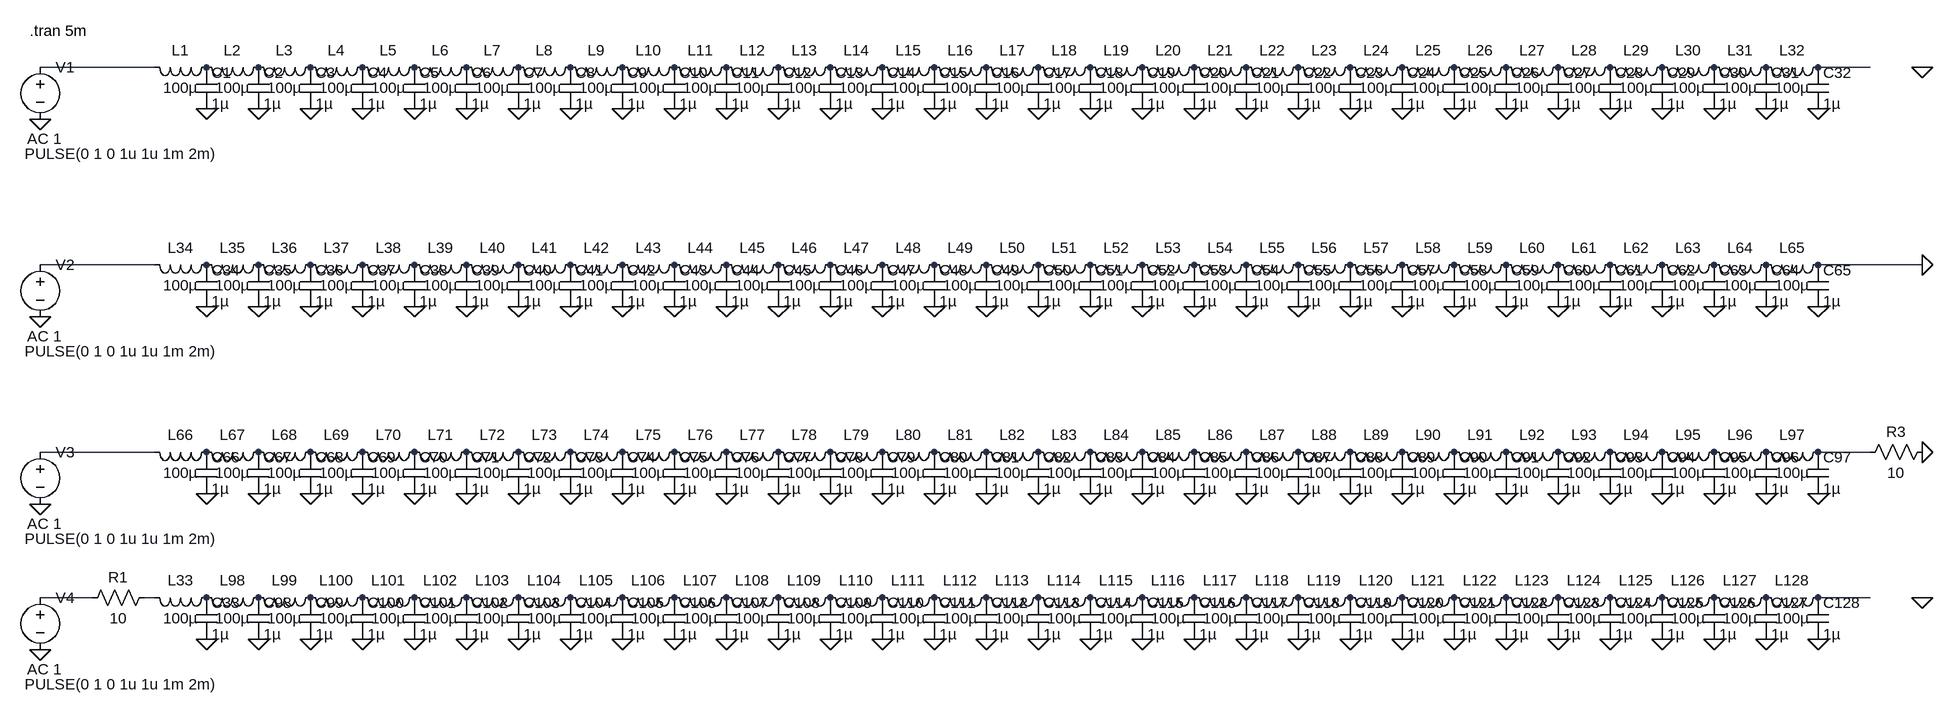
[diagram p0: schematic DistributedConstantCircuit.asc]
DistributedConstantCircuit.asc, the LTspice schematic file:
Version 4
SHEET 1 3316 1280
WIRE 64 96 -112 96
WIRE 2704 96 2624 96
WIRE 64 400 -112 400
WIRE 2784 400 2624 400
WIRE 64 688 -112 688
WIRE 2704 688 2624 688
WIRE -32 912 -112 912
WIRE 64 912 48 912
WIRE 2704 912 2624 912
FLAG -112 176 0
FLAG 144 160 0
FLAG 224 160 0
FLAG 304 160 0
FLAG 384 160 0
FLAG 464 160 0
FLAG 544 160 0
FLAG 624 160 0
FLAG 704 160 0
FLAG 784 160 0
FLAG 864 160 0
FLAG 944 160 0
FLAG 1024 160 0
FLAG 1104 160 0
FLAG 1184 160 0
FLAG 1264 160 0
FLAG 1344 160 0
FLAG 1424 160 0
FLAG 1504 160 0
FLAG 1584 160 0
FLAG 1664 160 0
FLAG 1744 160 0
FLAG 1824 160 0
FLAG 1904 160 0
FLAG 1984 160 0
FLAG 2064 160 0
FLAG 2144 160 0
FLAG 2224 160 0
FLAG 2304 160 0
FLAG 2384 160 0
FLAG 2464 160 0
FLAG 2544 160 0
FLAG 2624 160 0
FLAG 2784 96 0
FLAG -112 480 0
FLAG 144 464 0
FLAG 224 464 0
FLAG 304 464 0
FLAG 384 464 0
FLAG 464 464 0
FLAG 544 464 0
FLAG 624 464 0
FLAG 704 464 0
FLAG 784 464 0
FLAG 864 464 0
FLAG 944 464 0
FLAG 1024 464 0
FLAG 1104 464 0
FLAG 1184 464 0
FLAG 1264 464 0
FLAG 1344 464 0
FLAG 1424 464 0
FLAG 1504 464 0
FLAG 1584 464 0
FLAG 1664 464 0
FLAG 1744 464 0
FLAG 1824 464 0
FLAG 1904 464 0
FLAG 1984 464 0
FLAG 2064 464 0
FLAG 2144 464 0
FLAG 2224 464 0
FLAG 2304 464 0
FLAG 2384 464 0
FLAG 2464 464 0
FLAG 2544 464 0
FLAG 2624 464 0
FLAG 2784 400 0
FLAG -112 768 0
FLAG 144 752 0
FLAG 224 752 0
FLAG 304 752 0
FLAG 384 752 0
FLAG 464 752 0
FLAG 544 752 0
FLAG 624 752 0
FLAG 704 752 0
FLAG 784 752 0
FLAG 864 752 0
FLAG 944 752 0
FLAG 1024 752 0
FLAG 1104 752 0
FLAG 1184 752 0
FLAG 1264 752 0
FLAG 1344 752 0
FLAG 1424 752 0
FLAG 1504 752 0
FLAG 1584 752 0
FLAG 1664 752 0
FLAG 1744 752 0
FLAG 1824 752 0
FLAG 1904 752 0
FLAG 1984 752 0
FLAG 2064 752 0
FLAG 2144 752 0
FLAG 2224 752 0
FLAG 2304 752 0
FLAG 2384 752 0
FLAG 2464 752 0
FLAG 2544 752 0
FLAG 2624 752 0
FLAG 2784 688 0
FLAG -112 992 0
FLAG 144 976 0
FLAG 224 976 0
FLAG 304 976 0
FLAG 384 976 0
FLAG 464 976 0
FLAG 544 976 0
FLAG 624 976 0
FLAG 704 976 0
FLAG 784 976 0
FLAG 864 976 0
FLAG 944 976 0
FLAG 1024 976 0
FLAG 1104 976 0
FLAG 1184 976 0
FLAG 1264 976 0
FLAG 1344 976 0
FLAG 1424 976 0
FLAG 1504 976 0
FLAG 1584 976 0
FLAG 1664 976 0
FLAG 1744 976 0
FLAG 1824 976 0
FLAG 1904 976 0
FLAG 1984 976 0
FLAG 2064 976 0
FLAG 2144 976 0
FLAG 2224 976 0
FLAG 2304 976 0
FLAG 2384 976 0
FLAG 2464 976 0
FLAG 2544 976 0
FLAG 2624 976 0
FLAG 2784 912 0
SYMBOL ind 160 80 R90
WINDOW 0 5 56 VBottom 2
WINDOW 3 32 56 VTop 2
SYMATTR InstName L1
SYMATTR Value 100µ
SYMBOL cap 128 96 R0
SYMATTR InstName C1
SYMATTR Value 1µ
SYMBOL voltage -112 80 R0
WINDOW 3 -24 149 Left 2
WINDOW 123 -20 126 Left 2
WINDOW 39 0 0 Left 0
SYMATTR Value PULSE(0 1 0 1u 1u 1m 2m)
SYMATTR Value2 AC 1
SYMATTR InstName V1
SYMBOL ind 240 80 R90
WINDOW 0 5 56 VBottom 2
WINDOW 3 32 56 VTop 2
SYMATTR InstName L2
SYMATTR Value 100µ
SYMBOL cap 208 96 R0
SYMATTR InstName C2
SYMATTR Value 1µ
SYMBOL ind 320 80 R90
WINDOW 0 5 56 VBottom 2
WINDOW 3 32 56 VTop 2
SYMATTR InstName L3
SYMATTR Value 100µ
SYMBOL cap 288 96 R0
SYMATTR InstName C3
SYMATTR Value 1µ
SYMBOL ind 400 80 R90
WINDOW 0 5 56 VBottom 2
WINDOW 3 32 56 VTop 2
SYMATTR InstName L4
SYMATTR Value 100µ
SYMBOL cap 368 96 R0
SYMATTR InstName C4
SYMATTR Value 1µ
SYMBOL ind 480 80 R90
WINDOW 0 5 56 VBottom 2
WINDOW 3 32 56 VTop 2
SYMATTR InstName L5
SYMATTR Value 100µ
SYMBOL cap 448 96 R0
SYMATTR InstName C5
SYMATTR Value 1µ
SYMBOL ind 560 80 R90
WINDOW 0 5 56 VBottom 2
WINDOW 3 32 56 VTop 2
SYMATTR InstName L6
SYMATTR Value 100µ
SYMBOL cap 528 96 R0
SYMATTR InstName C6
SYMATTR Value 1µ
SYMBOL ind 640 80 R90
WINDOW 0 5 56 VBottom 2
WINDOW 3 32 56 VTop 2
SYMATTR InstName L7
SYMATTR Value 100µ
SYMBOL cap 608 96 R0
SYMATTR InstName C7
SYMATTR Value 1µ
SYMBOL ind 720 80 R90
WINDOW 0 5 56 VBottom 2
WINDOW 3 32 56 VTop 2
SYMATTR InstName L8
SYMATTR Value 100µ
SYMBOL cap 688 96 R0
SYMATTR InstName C8
SYMATTR Value 1µ
SYMBOL ind 800 80 R90
WINDOW 0 5 56 VBottom 2
WINDOW 3 32 56 VTop 2
SYMATTR InstName L9
SYMATTR Value 100µ
SYMBOL cap 768 96 R0
SYMATTR InstName C9
SYMATTR Value 1µ
SYMBOL ind 880 80 R90
WINDOW 0 5 56 VBottom 2
WINDOW 3 32 56 VTop 2
SYMATTR InstName L10
SYMATTR Value 100µ
SYMBOL cap 848 96 R0
SYMATTR InstName C10
SYMATTR Value 1µ
SYMBOL ind 960 80 R90
WINDOW 0 5 56 VBottom 2
WINDOW 3 32 56 VTop 2
SYMATTR InstName L11
SYMATTR Value 100µ
SYMBOL cap 928 96 R0
SYMATTR InstName C11
SYMATTR Value 1µ
SYMBOL ind 1040 80 R90
WINDOW 0 5 56 VBottom 2
WINDOW 3 32 56 VTop 2
SYMATTR InstName L12
SYMATTR Value 100µ
SYMBOL cap 1008 96 R0
SYMATTR InstName C12
SYMATTR Value 1µ
SYMBOL ind 1120 80 R90
WINDOW 0 5 56 VBottom 2
WINDOW 3 32 56 VTop 2
SYMATTR InstName L13
SYMATTR Value 100µ
SYMBOL cap 1088 96 R0
SYMATTR InstName C13
SYMATTR Value 1µ
SYMBOL ind 1200 80 R90
WINDOW 0 5 56 VBottom 2
WINDOW 3 32 56 VTop 2
SYMATTR InstName L14
SYMATTR Value 100µ
SYMBOL cap 1168 96 R0
SYMATTR InstName C14
SYMATTR Value 1µ
SYMBOL ind 1280 80 R90
WINDOW 0 5 56 VBottom 2
WINDOW 3 32 56 VTop 2
SYMATTR InstName L15
SYMATTR Value 100µ
SYMBOL cap 1248 96 R0
SYMATTR InstName C15
SYMATTR Value 1µ
SYMBOL ind 1360 80 R90
WINDOW 0 5 56 VBottom 2
WINDOW 3 32 56 VTop 2
SYMATTR InstName L16
SYMATTR Value 100µ
SYMBOL cap 1328 96 R0
SYMATTR InstName C16
SYMATTR Value 1µ
SYMBOL ind 1440 80 R90
WINDOW 0 5 56 VBottom 2
WINDOW 3 32 56 VTop 2
SYMATTR InstName L17
SYMATTR Value 100µ
SYMBOL cap 1408 96 R0
SYMATTR InstName C17
SYMATTR Value 1µ
SYMBOL ind 1520 80 R90
WINDOW 0 5 56 VBottom 2
WINDOW 3 32 56 VTop 2
SYMATTR InstName L18
SYMATTR Value 100µ
SYMBOL cap 1488 96 R0
SYMATTR InstName C18
SYMATTR Value 1µ
SYMBOL ind 1600 80 R90
WINDOW 0 5 56 VBottom 2
WINDOW 3 32 56 VTop 2
SYMATTR InstName L19
SYMATTR Value 100µ
SYMBOL cap 1568 96 R0
SYMATTR InstName C19
SYMATTR Value 1µ
SYMBOL ind 1680 80 R90
WINDOW 0 5 56 VBottom 2
WINDOW 3 32 56 VTop 2
SYMATTR InstName L20
SYMATTR Value 100µ
SYMBOL cap 1648 96 R0
SYMATTR InstName C20
SYMATTR Value 1µ
SYMBOL ind 1760 80 R90
WINDOW 0 5 56 VBottom 2
WINDOW 3 32 56 VTop 2
SYMATTR InstName L21
SYMATTR Value 100µ
SYMBOL cap 1728 96 R0
SYMATTR InstName C21
SYMATTR Value 1µ
SYMBOL ind 1840 80 R90
WINDOW 0 5 56 VBottom 2
WINDOW 3 32 56 VTop 2
SYMATTR InstName L22
SYMATTR Value 100µ
SYMBOL cap 1808 96 R0
SYMATTR InstName C22
SYMATTR Value 1µ
SYMBOL ind 1920 80 R90
WINDOW 0 5 56 VBottom 2
WINDOW 3 32 56 VTop 2
SYMATTR InstName L23
SYMATTR Value 100µ
SYMBOL cap 1888 96 R0
SYMATTR InstName C23
SYMATTR Value 1µ
SYMBOL ind 2000 80 R90
WINDOW 0 5 56 VBottom 2
WINDOW 3 32 56 VTop 2
SYMATTR InstName L24
SYMATTR Value 100µ
SYMBOL cap 1968 96 R0
SYMATTR InstName C24
SYMATTR Value 1µ
SYMBOL ind 2080 80 R90
WINDOW 0 5 56 VBottom 2
WINDOW 3 32 56 VTop 2
SYMATTR InstName L25
SYMATTR Value 100µ
SYMBOL cap 2048 96 R0
SYMATTR InstName C25
SYMATTR Value 1µ
SYMBOL ind 2160 80 R90
WINDOW 0 5 56 VBottom 2
WINDOW 3 32 56 VTop 2
SYMATTR InstName L26
SYMATTR Value 100µ
SYMBOL cap 2128 96 R0
SYMATTR InstName C26
SYMATTR Value 1µ
SYMBOL ind 2240 80 R90
WINDOW 0 5 56 VBottom 2
WINDOW 3 32 56 VTop 2
SYMATTR InstName L27
SYMATTR Value 100µ
SYMBOL cap 2208 96 R0
SYMATTR InstName C27
SYMATTR Value 1µ
SYMBOL ind 2320 80 R90
WINDOW 0 5 56 VBottom 2
WINDOW 3 32 56 VTop 2
SYMATTR InstName L28
SYMATTR Value 100µ
SYMBOL cap 2288 96 R0
SYMATTR InstName C28
SYMATTR Value 1µ
SYMBOL ind 2400 80 R90
WINDOW 0 5 56 VBottom 2
WINDOW 3 32 56 VTop 2
SYMATTR InstName L29
SYMATTR Value 100µ
SYMBOL cap 2368 96 R0
SYMATTR InstName C29
SYMATTR Value 1µ
SYMBOL ind 2480 80 R90
WINDOW 0 5 56 VBottom 2
WINDOW 3 32 56 VTop 2
SYMATTR InstName L30
SYMATTR Value 100µ
SYMBOL cap 2448 96 R0
SYMATTR InstName C30
SYMATTR Value 1µ
SYMBOL ind 2560 80 R90
WINDOW 0 5 56 VBottom 2
WINDOW 3 32 56 VTop 2
SYMATTR InstName L31
SYMATTR Value 100µ
SYMBOL cap 2528 96 R0
SYMATTR InstName C31
SYMATTR Value 1µ
SYMBOL ind 2640 80 R90
WINDOW 0 5 56 VBottom 2
WINDOW 3 32 56 VTop 2
SYMATTR InstName L32
SYMATTR Value 100µ
SYMBOL cap 2608 96 R0
SYMATTR InstName C32
SYMATTR Value 1µ
SYMBOL ind 160 384 R90
WINDOW 0 5 56 VBottom 2
WINDOW 3 32 56 VTop 2
SYMATTR InstName L34
SYMATTR Value 100µ
SYMBOL cap 128 400 R0
SYMATTR InstName C34
SYMATTR Value 1µ
SYMBOL ind 240 384 R90
WINDOW 0 5 56 VBottom 2
WINDOW 3 32 56 VTop 2
SYMATTR InstName L35
SYMATTR Value 100µ
SYMBOL cap 208 400 R0
SYMATTR InstName C35
SYMATTR Value 1µ
SYMBOL ind 320 384 R90
WINDOW 0 5 56 VBottom 2
WINDOW 3 32 56 VTop 2
SYMATTR InstName L36
SYMATTR Value 100µ
SYMBOL cap 288 400 R0
SYMATTR InstName C36
SYMATTR Value 1µ
SYMBOL ind 400 384 R90
WINDOW 0 5 56 VBottom 2
WINDOW 3 32 56 VTop 2
SYMATTR InstName L37
SYMATTR Value 100µ
SYMBOL cap 368 400 R0
SYMATTR InstName C37
SYMATTR Value 1µ
SYMBOL ind 480 384 R90
WINDOW 0 5 56 VBottom 2
WINDOW 3 32 56 VTop 2
SYMATTR InstName L38
SYMATTR Value 100µ
SYMBOL cap 448 400 R0
SYMATTR InstName C38
SYMATTR Value 1µ
SYMBOL ind 560 384 R90
WINDOW 0 5 56 VBottom 2
WINDOW 3 32 56 VTop 2
SYMATTR InstName L39
SYMATTR Value 100µ
SYMBOL cap 528 400 R0
SYMATTR InstName C39
SYMATTR Value 1µ
SYMBOL ind 640 384 R90
WINDOW 0 5 56 VBottom 2
WINDOW 3 32 56 VTop 2
SYMATTR InstName L40
SYMATTR Value 100µ
SYMBOL cap 608 400 R0
SYMATTR InstName C40
SYMATTR Value 1µ
SYMBOL ind 720 384 R90
WINDOW 0 5 56 VBottom 2
WINDOW 3 32 56 VTop 2
SYMATTR InstName L41
SYMATTR Value 100µ
SYMBOL cap 688 400 R0
SYMATTR InstName C41
SYMATTR Value 1µ
SYMBOL ind 800 384 R90
WINDOW 0 5 56 VBottom 2
WINDOW 3 32 56 VTop 2
SYMATTR InstName L42
SYMATTR Value 100µ
SYMBOL cap 768 400 R0
SYMATTR InstName C42
SYMATTR Value 1µ
SYMBOL ind 880 384 R90
WINDOW 0 5 56 VBottom 2
WINDOW 3 32 56 VTop 2
SYMATTR InstName L43
SYMATTR Value 100µ
SYMBOL cap 848 400 R0
SYMATTR InstName C43
SYMATTR Value 1µ
SYMBOL ind 960 384 R90
WINDOW 0 5 56 VBottom 2
WINDOW 3 32 56 VTop 2
SYMATTR InstName L44
SYMATTR Value 100µ
SYMBOL cap 928 400 R0
SYMATTR InstName C44
SYMATTR Value 1µ
SYMBOL ind 1040 384 R90
WINDOW 0 5 56 VBottom 2
WINDOW 3 32 56 VTop 2
SYMATTR InstName L45
SYMATTR Value 100µ
SYMBOL cap 1008 400 R0
SYMATTR InstName C45
SYMATTR Value 1µ
SYMBOL ind 1120 384 R90
WINDOW 0 5 56 VBottom 2
WINDOW 3 32 56 VTop 2
SYMATTR InstName L46
SYMATTR Value 100µ
SYMBOL cap 1088 400 R0
SYMATTR InstName C46
SYMATTR Value 1µ
SYMBOL ind 1200 384 R90
WINDOW 0 5 56 VBottom 2
WINDOW 3 32 56 VTop 2
SYMATTR InstName L47
SYMATTR Value 100µ
SYMBOL cap 1168 400 R0
SYMATTR InstName C47
SYMATTR Value 1µ
SYMBOL ind 1280 384 R90
WINDOW 0 5 56 VBottom 2
WINDOW 3 32 56 VTop 2
SYMATTR InstName L48
SYMATTR Value 100µ
SYMBOL cap 1248 400 R0
SYMATTR InstName C48
SYMATTR Value 1µ
SYMBOL ind 1360 384 R90
WINDOW 0 5 56 VBottom 2
WINDOW 3 32 56 VTop 2
SYMATTR InstName L49
SYMATTR Value 100µ
SYMBOL cap 1328 400 R0
SYMATTR InstName C49
SYMATTR Value 1µ
SYMBOL ind 1440 384 R90
WINDOW 0 5 56 VBottom 2
WINDOW 3 32 56 VTop 2
SYMATTR InstName L50
SYMATTR Value 100µ
SYMBOL cap 1408 400 R0
SYMATTR InstName C50
SYMATTR Value 1µ
SYMBOL ind 1520 384 R90
WINDOW 0 5 56 VBottom 2
WINDOW 3 32 56 VTop 2
SYMATTR InstName L51
SYMATTR Value 100µ
SYMBOL cap 1488 400 R0
SYMATTR InstName C51
SYMATTR Value 1µ
SYMBOL ind 1600 384 R90
WINDOW 0 5 56 VBottom 2
WINDOW 3 32 56 VTop 2
SYMATTR InstName L52
SYMATTR Value 100µ
SYMBOL cap 1568 400 R0
SYMATTR InstName C52
SYMATTR Value 1µ
SYMBOL ind 1680 384 R90
WINDOW 0 5 56 VBottom 2
WINDOW 3 32 56 VTop 2
SYMATTR InstName L53
SYMATTR Value 100µ
SYMBOL cap 1648 400 R0
SYMATTR InstName C53
SYMATTR Value 1µ
SYMBOL ind 1760 384 R90
WINDOW 0 5 56 VBottom 2
WINDOW 3 32 56 VTop 2
SYMATTR InstName L54
SYMATTR Value 100µ
SYMBOL cap 1728 400 R0
SYMATTR InstName C54
SYMATTR Value 1µ
SYMBOL ind 1840 384 R90
WINDOW 0 5 56 VBottom 2
WINDOW 3 32 56 VTop 2
SYMATTR InstName L55
SYMATTR Value 100µ
SYMBOL cap 1808 400 R0
SYMATTR InstName C55
SYMATTR Value 1µ
SYMBOL ind 1920 384 R90
WINDOW 0 5 56 VBottom 2
WINDOW 3 32 56 VTop 2
SYMATTR InstName L56
SYMATTR Value 100µ
SYMBOL cap 1888 400 R0
SYMATTR InstName C56
SYMATTR Value 1µ
SYMBOL ind 2000 384 R90
WINDOW 0 5 56 VBottom 2
WINDOW 3 32 56 VTop 2
SYMATTR InstName L57
SYMATTR Value 100µ
SYMBOL cap 1968 400 R0
SYMATTR InstName C57
SYMATTR Value 1µ
SYMBOL ind 2080 384 R90
WINDOW 0 5 56 VBottom 2
WINDOW 3 32 56 VTop 2
SYMATTR InstName L58
SYMATTR Value 100µ
SYMBOL cap 2048 400 R0
SYMATTR InstName C58
SYMATTR Value 1µ
SYMBOL ind 2160 384 R90
WINDOW 0 5 56 VBottom 2
WINDOW 3 32 56 VTop 2
SYMATTR InstName L59
SYMATTR Value 100µ
SYMBOL cap 2128 400 R0
SYMATTR InstName C59
SYMATTR Value 1µ
SYMBOL ind 2240 384 R90
WINDOW 0 5 56 VBottom 2
WINDOW 3 32 56 VTop 2
SYMATTR InstName L60
SYMATTR Value 100µ
SYMBOL cap 2208 400 R0
SYMATTR InstName C60
SYMATTR Value 1µ
SYMBOL ind 2320 384 R90
WINDOW 0 5 56 VBottom 2
WINDOW 3 32 56 VTop 2
SYMATTR InstName L61
SYMATTR Value 100µ
SYMBOL cap 2288 400 R0
SYMATTR InstName C61
SYMATTR Value 1µ
SYMBOL ind 2400 384 R90
WINDOW 0 5 56 VBottom 2
WINDOW 3 32 56 VTop 2
SYMATTR InstName L62
SYMATTR Value 100µ
SYMBOL cap 2368 400 R0
SYMATTR InstName C62
SYMATTR Value 1µ
SYMBOL ind 2480 384 R90
WINDOW 0 5 56 VBottom 2
WINDOW 3 32 56 VTop 2
SYMATTR InstName L63
SYMATTR Value 100µ
SYMBOL cap 2448 400 R0
SYMATTR InstName C63
SYMATTR Value 1µ
SYMBOL ind 2560 384 R90
WINDOW 0 5 56 VBottom 2
WINDOW 3 32 56 VTop 2
SYMATTR InstName L64
SYMATTR Value 100µ
SYMBOL cap 2528 400 R0
SYMATTR InstName C64
SYMATTR Value 1µ
SYMBOL ind 2640 384 R90
WINDOW 0 5 56 VBottom 2
WINDOW 3 32 56 VTop 2
SYMATTR InstName L65
SYMATTR Value 100µ
SYMBOL cap 2608 400 R0
SYMATTR InstName C65
SYMATTR Value 1µ
SYMBOL ind 160 672 R90
WINDOW 0 5 56 VBottom 2
WINDOW 3 32 56 VTop 2
SYMATTR InstName L66
SYMATTR Value 100µ
SYMBOL cap 128 688 R0
SYMATTR InstName C66
SYMATTR Value 1µ
SYMBOL ind 240 672 R90
WINDOW 0 5 56 VBottom 2
WINDOW 3 32 56 VTop 2
SYMATTR InstName L67
SYMATTR Value 100µ
SYMBOL cap 208 688 R0
SYMATTR InstName C67
SYMATTR Value 1µ
SYMBOL ind 320 672 R90
WINDOW 0 5 56 VBottom 2
WINDOW 3 32 56 VTop 2
SYMATTR InstName L68
SYMATTR Value 100µ
SYMBOL cap 288 688 R0
SYMATTR InstName C68
SYMATTR Value 1µ
SYMBOL ind 400 672 R90
WINDOW 0 5 56 VBottom 2
WINDOW 3 32 56 VTop 2
SYMATTR InstName L69
SYMATTR Value 100µ
SYMBOL cap 368 688 R0
SYMATTR InstName C69
SYMATTR Value 1µ
SYMBOL ind 480 672 R90
WINDOW 0 5 56 VBottom 2
WINDOW 3 32 56 VTop 2
SYMATTR InstName L70
SYMATTR Value 100µ
SYMBOL cap 448 688 R0
SYMATTR InstName C70
SYMATTR Value 1µ
SYMBOL ind 560 672 R90
WINDOW 0 5 56 VBottom 2
WINDOW 3 32 56 VTop 2
SYMATTR InstName L71
SYMATTR Value 100µ
SYMBOL cap 528 688 R0
SYMATTR InstName C71
SYMATTR Value 1µ
SYMBOL ind 640 672 R90
WINDOW 0 5 56 VBottom 2
WINDOW 3 32 56 VTop 2
SYMATTR InstName L72
SYMATTR Value 100µ
SYMBOL cap 608 688 R0
SYMATTR InstName C72
SYMATTR Value 1µ
SYMBOL ind 720 672 R90
WINDOW 0 5 56 VBottom 2
WINDOW 3 32 56 VTop 2
SYMATTR InstName L73
SYMATTR Value 100µ
SYMBOL cap 688 688 R0
SYMATTR InstName C73
SYMATTR Value 1µ
SYMBOL ind 800 672 R90
WINDOW 0 5 56 VBottom 2
WINDOW 3 32 56 VTop 2
SYMATTR InstName L74
SYMATTR Value 100µ
SYMBOL cap 768 688 R0
SYMATTR InstName C74
SYMATTR Value 1µ
SYMBOL ind 880 672 R90
WINDOW 0 5 56 VBottom 2
WINDOW 3 32 56 VTop 2
SYMATTR InstName L75
SYMATTR Value 100µ
SYMBOL cap 848 688 R0
SYMATTR InstName C75
SYMATTR Value 1µ
SYMBOL ind 960 672 R90
WINDOW 0 5 56 VBottom 2
WINDOW 3 32 56 VTop 2
SYMATTR InstName L76
SYMATTR Value 100µ
SYMBOL cap 928 688 R0
SYMATTR InstName C76
SYMATTR Value 1µ
SYMBOL ind 1040 672 R90
WINDOW 0 5 56 VBottom 2
WINDOW 3 32 56 VTop 2
SYMATTR InstName L77
SYMATTR Value 100µ
SYMBOL cap 1008 688 R0
SYMATTR InstName C77
SYMATTR Value 1µ
SYMBOL ind 1120 672 R90
WINDOW 0 5 56 VBottom 2
WINDOW 3 32 56 VTop 2
SYMATTR InstName L78
SYMATTR Value 100µ
SYMBOL cap 1088 688 R0
SYMATTR InstName C78
SYMATTR Value 1µ
SYMBOL ind 1200 672 R90
WINDOW 0 5 56 VBottom 2
WINDOW 3 32 56 VTop 2
SYMATTR InstName L79
SYMATTR Value 100µ
SYMBOL cap 1168 688 R0
SYMATTR InstName C79
SYMATTR Value 1µ
SYMBOL ind 1280 672 R90
WINDOW 0 5 56 VBottom 2
WINDOW 3 32 56 VTop 2
SYMATTR InstName L80
SYMATTR Value 100µ
SYMBOL cap 1248 688 R0
SYMATTR InstName C80
SYMATTR Value 1µ
SYMBOL ind 1360 672 R90
WINDOW 0 5 56 VBottom 2
WINDOW 3 32 56 VTop 2
SYMATTR InstName L81
SYMATTR Value 100µ
SYMBOL cap 1328 688 R0
SYMATTR InstName C81
SYMATTR Value 1µ
SYMBOL ind 1440 672 R90
WINDOW 0 5 56 VBottom 2
WINDOW 3 32 56 VTop 2
SYMATTR InstName L82
SYMATTR Value 100µ
SYMBOL cap 1408 688 R0
SYMATTR InstName C82
SYMATTR Value 1µ
SYMBOL ind 1520 672 R90
WINDOW 0 5 56 VBottom 2
WINDOW 3 32 56 VTop 2
SYMATTR InstName L83
SYMATTR Value 100µ
SYMBOL cap 1488 688 R0
SYMATTR InstName C83
SYMATTR Value 1µ
SYMBOL ind 1600 672 R90
WINDOW 0 5 56 VBottom 2
WINDOW 3 32 56 VTop 2
SYMATTR InstName L84
SYMATTR Value 100µ
SYMBOL cap 1568 688 R0
SYMATTR InstName C84
SYMATTR Value 1µ
SYMBOL ind 1680 672 R90
WINDOW 0 5 56 VBottom 2
WINDOW 3 32 56 VTop 2
SYMATTR InstName L85
SYMATTR Value 100µ
SYMBOL cap 1648 688 R0
SYMATTR InstName C85
SYMATTR Value 1µ
SYMBOL ind 1760 672 R90
WINDOW 0 5 56 VBottom 2
WINDOW 3 32 56 VTop 2
SYMATTR InstName L86
SYMATTR Value 100µ
SYMBOL cap 1728 688 R0
SYMATTR InstName C86
SYMATTR Value 1µ
SYMBOL ind 1840 672 R90
WINDOW 0 5 56 VBottom 2
WINDOW 3 32 56 VTop 2
SYMATTR InstName L87
SYMATTR Value 100µ
SYMBOL cap 1808 688 R0
SYMATTR InstName C87
SYMATTR Value 1µ
SYMBOL ind 1920 672 R90
WINDOW 0 5 56 VBottom 2
WINDOW 3 32 56 VTop 2
SYMATTR InstName L88
SYMATTR Value 100µ
SYMBOL cap 1888 688 R0
SYMATTR InstName C88
SYMATTR Value 1µ
SYMBOL ind 2000 672 R90
WINDOW 0 5 56 VBottom 2
WINDOW 3 32 56 VTop 2
SYMATTR InstName L89
SYMATTR Value 100µ
SYMBOL cap 1968 688 R0
SYMATTR InstName C89
SYMATTR Value 1µ
SYMBOL ind 2080 672 R90
WINDOW 0 5 56 VBottom 2
WINDOW 3 32 56 VTop 2
SYMATTR InstName L90
SYMATTR Value 100µ
SYMBOL cap 2048 688 R0
SYMATTR InstName C90
SYMATTR Value 1µ
SYMBOL ind 2160 672 R90
WINDOW 0 5 56 VBottom 2
WINDOW 3 32 56 VTop 2
SYMATTR InstName L91
SYMATTR Value 100µ
SYMBOL cap 2128 688 R0
SYMATTR InstName C91
SYMATTR Value 1µ
SYMBOL ind 2240 672 R90
WINDOW 0 5 56 VBottom 2
WINDOW 3 32 56 VTop 2
SYMATTR InstName L92
SYMATTR Value 100µ
SYMBOL cap 2208 688 R0
SYMATTR InstName C92
SYMATTR Value 1µ
SYMBOL ind 2320 672 R90
WINDOW 0 5 56 VBottom 2
WINDOW 3 32 56 VTop 2
SYMATTR InstName L93
SYMATTR Value 100µ
SYMBOL cap 2288 688 R0
SYMATTR InstName C93
SYMATTR Value 1µ
SYMBOL ind 2400 672 R90
WINDOW 0 5 56 VBottom 2
WINDOW 3 32 56 VTop 2
SYMATTR InstName L94
SYMATTR Value 100µ
SYMBOL cap 2368 688 R0
SYMATTR InstName C94
SYMATTR Value 1µ
SYMBOL ind 2480 672 R90
WINDOW 0 5 56 VBottom 2
WINDOW 3 32 56 VTop 2
SYMATTR InstName L95
SYMATTR Value 100µ
SYMBOL cap 2448 688 R0
SYMATTR InstName C95
SYMATTR Value 1µ
SYMBOL ind 2560 672 R90
WINDOW 0 5 56 VBottom 2
WINDOW 3 32 56 VTop 2
SYMATTR InstName L96
SYMATTR Value 100µ
SYMBOL cap 2528 688 R0
SYMATTR InstName C96
SYMATTR Value 1µ
SYMBOL ind 2640 672 R90
WINDOW 0 5 56 VBottom 2
WINDOW 3 32 56 VTop 2
SYMATTR InstName L97
SYMATTR Value 100µ
SYMBOL cap 2608 688 R0
SYMATTR InstName C97
SYMATTR Value 1µ
SYMBOL res 2800 672 R90
WINDOW 0 0 56 VBottom 2
WINDOW 3 32 56 VTop 2
SYMATTR InstName R3
SYMATTR Value 10
SYMBOL ind 160 896 R90
WINDOW 0 5 56 VBottom 2
WINDOW 3 32 56 VTop 2
SYMATTR InstName L33
SYMATTR Value 100µ
SYMBOL cap 128 912 R0
SYMATTR InstName C33
SYMATTR Value 1µ
SYMBOL ind 240 896 R90
WINDOW 0 5 56 VBottom 2
WINDOW 3 32 56 VTop 2
SYMATTR InstName L98
SYMATTR Value 100µ
SYMBOL cap 208 912 R0
SYMATTR InstName C98
SYMATTR Value 1µ
SYMBOL ind 320 896 R90
WINDOW 0 5 56 VBottom 2
WINDOW 3 32 56 VTop 2
SYMATTR InstName L99
SYMATTR Value 100µ
SYMBOL cap 288 912 R0
SYMATTR InstName C99
SYMATTR Value 1µ
SYMBOL ind 400 896 R90
WINDOW 0 5 56 VBottom 2
WINDOW 3 32 56 VTop 2
SYMATTR InstName L100
SYMATTR Value 100µ
SYMBOL cap 368 912 R0
SYMATTR InstName C100
SYMATTR Value 1µ
SYMBOL ind 480 896 R90
WINDOW 0 5 56 VBottom 2
WINDOW 3 32 56 VTop 2
SYMATTR InstName L101
SYMATTR Value 100µ
SYMBOL cap 448 912 R0
SYMATTR InstName C101
SYMATTR Value 1µ
SYMBOL ind 560 896 R90
WINDOW 0 5 56 VBottom 2
WINDOW 3 32 56 VTop 2
SYMATTR InstName L102
SYMATTR Value 100µ
SYMBOL cap 528 912 R0
SYMATTR InstName C102
SYMATTR Value 1µ
SYMBOL ind 640 896 R90
WINDOW 0 5 56 VBottom 2
WINDOW 3 32 56 VTop 2
SYMATTR InstName L103
SYMATTR Value 100µ
SYMBOL cap 608 912 R0
SYMATTR InstName C103
SYMATTR Value 1µ
SYMBOL ind 720 896 R90
WINDOW 0 5 56 VBottom 2
WINDOW 3 32 56 VTop 2
SYMATTR InstName L104
SYMATTR Value 100µ
SYMBOL cap 688 912 R0
SYMATTR InstName C104
SYMATTR Value 1µ
SYMBOL ind 800 896 R90
WINDOW 0 5 56 VBottom 2
WINDOW 3 32 56 VTop 2
SYMATTR InstName L105
SYMATTR Value 100µ
SYMBOL cap 768 912 R0
SYMATTR InstName C105
SYMATTR Value 1µ
SYMBOL ind 880 896 R90
WINDOW 0 5 56 VBottom 2
WINDOW 3 32 56 VTop 2
SYMATTR InstName L106
SYMATTR Value 100µ
SYMBOL cap 848 912 R0
SYMATTR InstName C106
SYMATTR Value 1µ
SYMBOL ind 960 896 R90
WINDOW 0 5 56 VBottom 2
WINDOW 3 32 56 VTop 2
SYMATTR InstName L107
SYMATTR Value 100µ
SYMBOL cap 928 912 R0
SYMATTR InstName C107
SYMATTR Value 1µ
SYMBOL ind 1040 896 R90
WINDOW 0 5 56 VBottom 2
WINDOW 3 32 56 VTop 2
SYMATTR InstName L108
SYMATTR Value 100µ
SYMBOL cap 1008 912 R0
SYMATTR InstName C108
SYMATTR Value 1µ
SYMBOL ind 1120 896 R90
WINDOW 0 5 56 VBottom 2
WINDOW 3 32 56 VTop 2
SYMATTR InstName L109
SYMATTR Value 100µ
SYMBOL cap 1088 912 R0
SYMATTR InstName C109
SYMATTR Value 1µ
SYMBOL ind 1200 896 R90
WINDOW 0 5 56 VBottom 2
WINDOW 3 32 56 VTop 2
SYMATTR InstName L110
SYMATTR Value 100µ
SYMBOL cap 1168 912 R0
SYMATTR InstName C110
SYMATTR Value 1µ
SYMBOL ind 1280 896 R90
WINDOW 0 5 56 VBottom 2
WINDOW 3 32 56 VTop 2
SYMATTR InstName L111
SYMATTR Value 100µ
SYMBOL cap 1248 912 R0
SYMATTR InstName C111
SYMATTR Value 1µ
SYMBOL ind 1360 896 R90
WINDOW 0 5 56 VBottom 2
WINDOW 3 32 56 VTop 2
SYMATTR InstName L112
SYMATTR Value 100µ
SYMBOL cap 1328 912 R0
SYMATTR InstName C112
SYMATTR Value 1µ
SYMBOL ind 1440 896 R90
WINDOW 0 5 56 VBottom 2
WINDOW 3 32 56 VTop 2
SYMATTR InstName L113
SYMATTR Value 100µ
SYMBOL cap 1408 912 R0
SYMATTR InstName C113
SYMATTR Value 1µ
SYMBOL ind 1520 896 R90
WINDOW 0 5 56 VBottom 2
WINDOW 3 32 56 VTop 2
SYMATTR InstName L114
SYMATTR Value 100µ
SYMBOL cap 1488 912 R0
SYMATTR InstName C114
SYMATTR Value 1µ
SYMBOL ind 1600 896 R90
WINDOW 0 5 56 VBottom 2
WINDOW 3 32 56 VTop 2
SYMATTR InstName L115
SYMATTR Value 100µ
SYMBOL cap 1568 912 R0
SYMATTR InstName C115
SYMATTR Value 1µ
SYMBOL ind 1680 896 R90
WINDOW 0 5 56 VBottom 2
WINDOW 3 32 56 VTop 2
SYMATTR InstName L116
SYMATTR Value 100µ
SYMBOL cap 1648 912 R0
SYMATTR InstName C116
SYMATTR Value 1µ
SYMBOL ind 1760 896 R90
WINDOW 0 5 56 VBottom 2
WINDOW 3 32 56 VTop 2
SYMATTR InstName L117
SYMATTR Value 100µ
SYMBOL cap 1728 912 R0
SYMATTR InstName C117
SYMATTR Value 1µ
SYMBOL ind 1840 896 R90
WINDOW 0 5 56 VBottom 2
WINDOW 3 32 56 VTop 2
SYMATTR InstName L118
SYMATTR Value 100µ
SYMBOL cap 1808 912 R0
SYMATTR InstName C118
SYMATTR Value 1µ
SYMBOL ind 1920 896 R90
WINDOW 0 5 56 VBottom 2
WINDOW 3 32 56 VTop 2
SYMATTR InstName L119
SYMATTR Value 100µ
SYMBOL cap 1888 912 R0
SYMATTR InstName C119
SYMATTR Value 1µ
SYMBOL ind 2000 896 R90
WINDOW 0 5 56 VBottom 2
WINDOW 3 32 56 VTop 2
SYMATTR InstName L120
SYMATTR Value 100µ
SYMBOL cap 1968 912 R0
SYMATTR InstName C120
SYMATTR Value 1µ
SYMBOL ind 2080 896 R90
WINDOW 0 5 56 VBottom 2
WINDOW 3 32 56 VTop 2
SYMATTR InstName L121
SYMATTR Value 100µ
SYMBOL cap 2048 912 R0
SYMATTR InstName C121
SYMATTR Value 1µ
SYMBOL ind 2160 896 R90
WINDOW 0 5 56 VBottom 2
WINDOW 3 32 56 VTop 2
SYMATTR InstName L122
SYMATTR Value 100µ
SYMBOL cap 2128 912 R0
SYMATTR InstName C122
SYMATTR Value 1µ
SYMBOL ind 2240 896 R90
WINDOW 0 5 56 VBottom 2
WINDOW 3 32 56 VTop 2
SYMATTR InstName L123
SYMATTR Value 100µ
SYMBOL cap 2208 912 R0
SYMATTR InstName C123
SYMATTR Value 1µ
SYMBOL ind 2320 896 R90
WINDOW 0 5 56 VBottom 2
WINDOW 3 32 56 VTop 2
SYMATTR InstName L124
SYMATTR Value 100µ
SYMBOL cap 2288 912 R0
SYMATTR InstName C124
SYMATTR Value 1µ
SYMBOL ind 2400 896 R90
WINDOW 0 5 56 VBottom 2
WINDOW 3 32 56 VTop 2
SYMATTR InstName L125
SYMATTR Value 100µ
SYMBOL cap 2368 912 R0
SYMATTR InstName C125
SYMATTR Value 1µ
SYMBOL ind 2480 896 R90
WINDOW 0 5 56 VBottom 2
WINDOW 3 32 56 VTop 2
SYMATTR InstName L126
SYMATTR Value 100µ
SYMBOL cap 2448 912 R0
SYMATTR InstName C126
SYMATTR Value 1µ
SYMBOL ind 2560 896 R90
WINDOW 0 5 56 VBottom 2
WINDOW 3 32 56 VTop 2
SYMATTR InstName L127
SYMATTR Value 100µ
SYMBOL cap 2528 912 R0
SYMATTR InstName C127
SYMATTR Value 1µ
SYMBOL ind 2640 896 R90
WINDOW 0 5 56 VBottom 2
WINDOW 3 32 56 VTop 2
SYMATTR InstName L128
SYMATTR Value 100µ
SYMBOL cap 2608 912 R0
SYMATTR InstName C128
SYMATTR Value 1µ
SYMBOL res 64 896 R90
WINDOW 0 0 56 VBottom 2
WINDOW 3 32 56 VTop 2
SYMATTR InstName R1
SYMATTR Value 10
SYMBOL voltage -112 384 R0
WINDOW 3 -24 149 Left 2
WINDOW 123 -20 126 Left 2
WINDOW 39 0 0 Left 0
SYMATTR Value PULSE(0 1 0 1u 1u 1m 2m)
SYMATTR Value2 AC 1
SYMATTR InstName V2
SYMBOL voltage -112 672 R0
WINDOW 3 -24 149 Left 2
WINDOW 123 -20 126 Left 2
WINDOW 39 0 0 Left 0
SYMATTR Value PULSE(0 1 0 1u 1u 1m 2m)
SYMATTR Value2 AC 1
SYMATTR InstName V3
SYMBOL voltage -112 896 R0
WINDOW 3 -24 149 Left 2
WINDOW 123 -20 126 Left 2
WINDOW 39 0 0 Left 0
SYMATTR Value PULSE(0 1 0 1u 1u 1m 2m)
SYMATTR Value2 AC 1
SYMATTR InstName V4
TEXT -128 40 Left 2 !.tran 5m

The netlist it stands for:
* DistributedConstantCircuit.asc
L1 P001 N001 100µ
C1 P001 0 1µ
V1 N001 0 PULSE(0 1 0 1u 1u 1m 2m) AC 1
L2 P002 P001 100µ
C2 P002 0 1µ
L3 P003 P002 100µ
C3 P003 0 1µ
L4 P004 P003 100µ
C4 P004 0 1µ
L5 P005 P004 100µ
C5 P005 0 1µ
L6 P006 P005 100µ
C6 P006 0 1µ
L7 P007 P006 100µ
C7 P007 0 1µ
L8 P008 P007 100µ
C8 P008 0 1µ
L9 P009 P008 100µ
C9 P009 0 1µ
L10 P010 P009 100µ
C10 P010 0 1µ
L11 P011 P010 100µ
C11 P011 0 1µ
L12 P012 P011 100µ
C12 P012 0 1µ
L13 P013 P012 100µ
C13 P013 0 1µ
L14 P014 P013 100µ
C14 P014 0 1µ
L15 P015 P014 100µ
C15 P015 0 1µ
L16 P016 P015 100µ
C16 P016 0 1µ
L17 P017 P016 100µ
C17 P017 0 1µ
L18 P018 P017 100µ
C18 P018 0 1µ
L19 P019 P018 100µ
C19 P019 0 1µ
L20 P020 P019 100µ
C20 P020 0 1µ
L21 P021 P020 100µ
C21 P021 0 1µ
L22 P022 P021 100µ
C22 P022 0 1µ
L23 P023 P022 100µ
C23 P023 0 1µ
L24 P024 P023 100µ
C24 P024 0 1µ
L25 P025 P024 100µ
C25 P025 0 1µ
L26 P026 P025 100µ
C26 P026 0 1µ
L27 P027 P026 100µ
C27 P027 0 1µ
L28 P028 P027 100µ
C28 P028 0 1µ
L29 P029 P028 100µ
C29 P029 0 1µ
L30 P030 P029 100µ
C30 P030 0 1µ
L31 P031 P030 100µ
C31 P031 0 1µ
L32 N002 P031 100µ
C32 N002 0 1µ
L34 P032 N003 100µ
C34 P032 0 1µ
L35 P033 P032 100µ
C35 P033 0 1µ
L36 P034 P033 100µ
C36 P034 0 1µ
L37 P035 P034 100µ
C37 P035 0 1µ
L38 P036 P035 100µ
C38 P036 0 1µ
L39 P037 P036 100µ
C39 P037 0 1µ
L40 P038 P037 100µ
C40 P038 0 1µ
L41 P039 P038 100µ
C41 P039 0 1µ
L42 P040 P039 100µ
C42 P040 0 1µ
L43 P041 P040 100µ
C43 P041 0 1µ
L44 P042 P041 100µ
C44 P042 0 1µ
L45 P043 P042 100µ
C45 P043 0 1µ
L46 P044 P043 100µ
C46 P044 0 1µ
L47 P045 P044 100µ
C47 P045 0 1µ
L48 P046 P045 100µ
C48 P046 0 1µ
L49 P047 P046 100µ
C49 P047 0 1µ
L50 P048 P047 100µ
C50 P048 0 1µ
L51 P049 P048 100µ
C51 P049 0 1µ
L52 P050 P049 100µ
C52 P050 0 1µ
L53 P051 P050 100µ
C53 P051 0 1µ
L54 P052 P051 100µ
C54 P052 0 1µ
L55 P053 P052 100µ
C55 P053 0 1µ
L56 P054 P053 100µ
C56 P054 0 1µ
L57 P055 P054 100µ
C57 P055 0 1µ
L58 P056 P055 100µ
C58 P056 0 1µ
L59 P057 P056 100µ
C59 P057 0 1µ
L60 P058 P057 100µ
C60 P058 0 1µ
L61 P059 P058 100µ
C61 P059 0 1µ
L62 P060 P059 100µ
C62 P060 0 1µ
L63 P061 P060 100µ
C63 P061 0 1µ
L64 P062 P061 100µ
C64 P062 0 1µ
L65 0 P062 100µ
C65 0 0 1µ
L66 P063 N004 100µ
C66 P063 0 1µ
L67 P064 P063 100µ
C67 P064 0 1µ
L68 P065 P064 100µ
C68 P065 0 1µ
L69 P066 P065 100µ
C69 P066 0 1µ
L70 P067 P066 100µ
C70 P067 0 1µ
L71 P068 P067 100µ
C71 P068 0 1µ
L72 P069 P068 100µ
C72 P069 0 1µ
L73 P070 P069 100µ
C73 P070 0 1µ
L74 P071 P070 100µ
C74 P071 0 1µ
L75 P072 P071 100µ
C75 P072 0 1µ
L76 P073 P072 100µ
C76 P073 0 1µ
L77 P074 P073 100µ
C77 P074 0 1µ
L78 P075 P074 100µ
C78 P075 0 1µ
L79 P076 P075 100µ
C79 P076 0 1µ
L80 P077 P076 100µ
C80 P077 0 1µ
L81 P078 P077 100µ
C81 P078 0 1µ
L82 P079 P078 100µ
C82 P079 0 1µ
L83 P080 P079 100µ
C83 P080 0 1µ
L84 P081 P080 100µ
C84 P081 0 1µ
L85 P082 P081 100µ
C85 P082 0 1µ
L86 P083 P082 100µ
C86 P083 0 1µ
L87 P084 P083 100µ
C87 P084 0 1µ
L88 P085 P084 100µ
C88 P085 0 1µ
L89 P086 P085 100µ
C89 P086 0 1µ
L90 P087 P086 100µ
C90 P087 0 1µ
L91 P088 P087 100µ
C91 P088 0 1µ
L92 P089 P088 100µ
C92 P089 0 1µ
L93 P090 P089 100µ
C93 P090 0 1µ
L94 P091 P090 100µ
C94 P091 0 1µ
L95 P092 P091 100µ
C95 P092 0 1µ
L96 P093 P092 100µ
C96 P093 0 1µ
L97 N005 P093 100µ
C97 N005 0 1µ
R3 0 N005 10
L33 P094 N007 100µ
C33 P094 0 1µ
L98 P095 P094 100µ
C98 P095 0 1µ
L99 P096 P095 100µ
C99 P096 0 1µ
L100 P097 P096 100µ
C100 P097 0 1µ
L101 P098 P097 100µ
C101 P098 0 1µ
L102 P099 P098 100µ
C102 P099 0 1µ
L103 P100 P099 100µ
C103 P100 0 1µ
L104 P101 P100 100µ
C104 P101 0 1µ
L105 P102 P101 100µ
C105 P102 0 1µ
L106 P103 P102 100µ
C106 P103 0 1µ
L107 P104 P103 100µ
C107 P104 0 1µ
L108 P105 P104 100µ
C108 P105 0 1µ
L109 P106 P105 100µ
C109 P106 0 1µ
L110 P107 P106 100µ
C110 P107 0 1µ
L111 P108 P107 100µ
C111 P108 0 1µ
L112 P109 P108 100µ
C112 P109 0 1µ
L113 P110 P109 100µ
C113 P110 0 1µ
L114 P111 P110 100µ
C114 P111 0 1µ
L115 P112 P111 100µ
C115 P112 0 1µ
L116 P113 P112 100µ
C116 P113 0 1µ
L117 P114 P113 100µ
C117 P114 0 1µ
L118 P115 P114 100µ
C118 P115 0 1µ
L119 P116 P115 100µ
C119 P116 0 1µ
L120 P117 P116 100µ
C120 P117 0 1µ
L121 P118 P117 100µ
C121 P118 0 1µ
L122 P119 P118 100µ
C122 P119 0 1µ
L123 P120 P119 100µ
C123 P120 0 1µ
L124 P121 P120 100µ
C124 P121 0 1µ
L125 P122 P121 100µ
C125 P122 0 1µ
L126 P123 P122 100µ
C126 P123 0 1µ
L127 P124 P123 100µ
C127 P124 0 1µ
L128 N008 P124 100µ
C128 N008 0 1µ
R1 N007 N006 10
V2 N003 0 PULSE(0 1 0 1u 1u 1m 2m) AC 1
V3 N004 0 PULSE(0 1 0 1u 1u 1m 2m) AC 1
V4 N006 0 PULSE(0 1 0 1u 1u 1m 2m) AC 1
.tran 5m
.backanno
.end